# EasyEDA schematic SCH_ACSI2STM-MINI_2026-07-24.json
TITLE: ACSI2STM MINI - SidecarTridge version; REV: 1.0; Date: 2023-08-24; Sheet: 1/1; Drawn By: Jean-Matthieu Coulon; Company: retro16
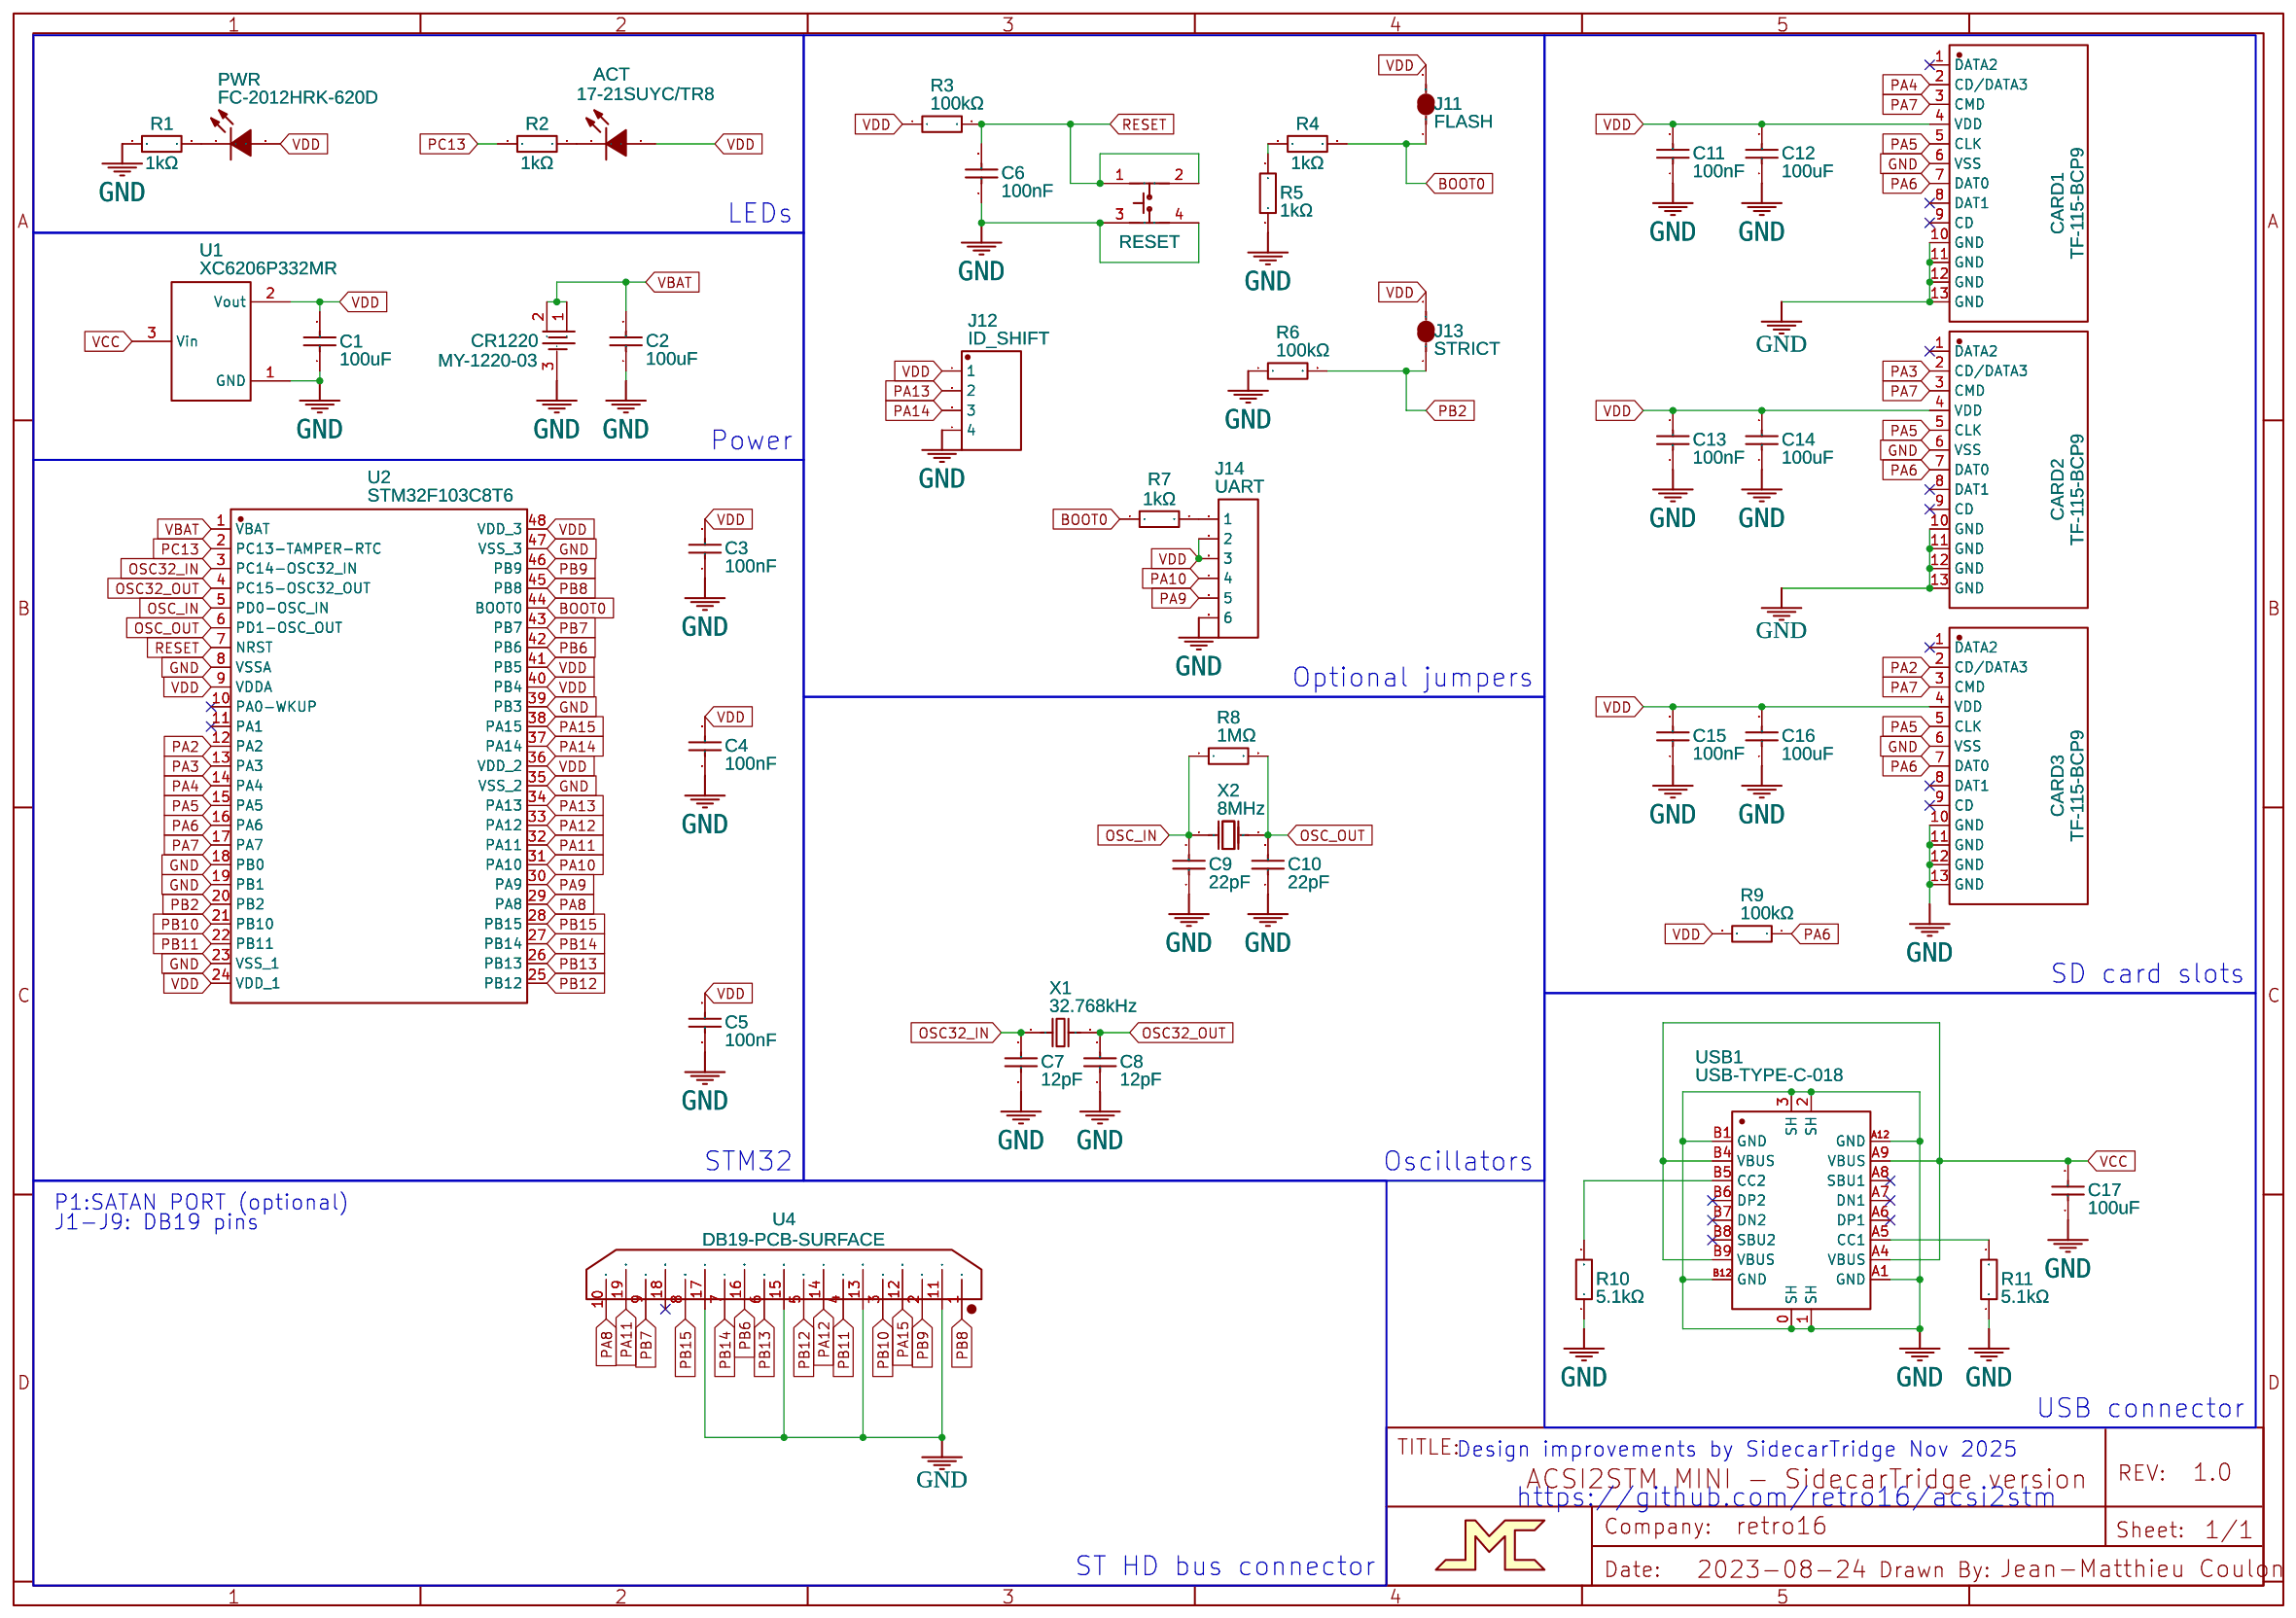
[diagram p0: schematic sheet]

## Parts
ACT  17-21SUYC/TR8  [LED0805-R-RD]
C1  100uF  [C1206]
C2  100uF  [C1206]
C3  100nF  [C0402]
C4  100nF  [C0402]
C5  100nF  [C0402]
C6  100nF  [C0402]
C7  12pF  [C0402]
C8  12pF  [C0402]
C9  22pF  [C0402]
C10  22pF  [C0402]
C11  100nF  [C0402]
C12  100uF  [C1206]
C13  100nF  [C0402]
C14  100uF  [C1206]
C15  100nF  [C1206]
C16  100uF  [C1206]
C17  100uF  [C1206]
CARD1  TF-115-BCP9  [TF-SMD_TF-115-BCP9]
CARD2  TF-115-BCP9  [TF-SMD_TF-115-BCP9]
CARD3  TF-115-BCP9  [TF-SMD_TF-115-BCP9]
CR1220  MY-1220-03  [BAT-SMD_MY-1220-03]
J11  FLASH  [SJ_2S-NO]
J12  ID_SHIFT  [SJ_4]
J13  STRICT  [SJ_2S-NO]
J14  UART  [HDR-F-2.54_1X6]
PWR  FC-2012HRK-620D  [LED0805-RD_RED]
R1  1kΩ  [R0402]
R2  1kΩ  [R0402]
R3  100kΩ  [R0402]
R4  1kΩ  [R0402]
R5  1kΩ  [R0402]
R6  100kΩ  [R0402]
R7  1kΩ  [R0402]
R8  1MΩ  [R0402]
R9  100kΩ  [R0402]
R10  5.1kΩ  [R0402]
R11  5.1kΩ  [R0402]
RESET  SKRPABE010  [KEY-SMD_4P-L4.2-W3.2-P2.20-LS4.6]
U1  XC6206P332MR  [SOT-23-3_L2.9-W1.6-P1.90-LS2.8-BR]
U2  STM32F103C8T6  [LQFP-48_L7.0-W7.0-P0.50-LS9.0-BL]
U3  JMC_LOGO  [JMC_LOGO]
U4  DB19-PCB-SURFACE  [DB19-PCB-SURFACE]
USB1  USB-TYPE-C-018  [USB-C_SMD-TYPE-C-31-M-12]
X1  32.768kHz  [FC-135R_L3.2-W1.5]
X2  8MHz  [CRYSTAL-SMD_L5.0-W3.2]

## Library data of the parts
ACT = 17-21SUYC/TR8: Supplier: LCSC; Manufacturer: KENTO; Manufacturer Part: KT-0805黄灯; Supplier Part: C2296; JLCPCB Part Class: Basic Part
C1 C2 C12 C14 C16 C17 = CL31A107MQHNNNE: Supplier: LCSC; Manufacturer: SAMSUNG(三星); Supplier Part: C15008; JLCPCB Part Class: Basic Part
C3-C6 C11 C13 = CL05B104KO5NNNC: Supplier: LCSC; Manufacturer: SAMSUNG(三星); Supplier Part: C1525; JLCPCB Part Class: Basic Part
C7 C8 = 0402CG120J500NT: Supplier: LCSC; Manufacturer: FH(风华); Supplier Part: C1547; JLCPCB Part Class: Basic Part
C9 C10 = 0402CG220J500NT: Supplier: LCSC; Manufacturer: FH(风华); Supplier Part: C1555; JLCPCB Part Class: Basic Part
C15 = CL31B104KBCNNNC: Supplier: LCSC; Manufacturer: SAMSUNG(三星); Supplier Part: C24497; JLCPCB Part Class: Basic Part
CARD1-CARD3 = TF-115-BCP9: Contributor: LCSC; Supplier: LCSC; Supplier Part: C720505; Manufacturer: XUNPU(讯普); JLCPCB Part Class: Extended Part
CR1220 = MY-1220-03: Supplier: LCSC; Supplier Part: C964818; Manufacturer: MYOUNG(美阳); Contributor: lcsc; JLCPCB Part Class: Extended Part
J11 J13 = SOLDERJUMPERNO: Solder Jumper; Contributor: SparkFun
J12 = SJ-4PAD: Contributor: LCSC; Package Display: No
J14 = HDR-F-2.54_1x6: Supplier Part: C40877; Supplier: LCSC; Contributor: LCEDA_Lib
PWR = FC-2012HRK-620D: Supplier: LCSC; Manufacturer: 国星光电; Manufacturer Part: NCD0805R1; Supplier Part: C84256; JLCPCB Part Class: Basic Part
R1 R2 R4 R5 R7 = 0402WGF1001TCE: Supplier: LCSC; Manufacturer: UNI-ROYAL(厚声); Supplier Part: C11702; Resistance (Ohms): 1K; JLCPCB Part Class: Basic Part
R3 R6 R9 = 0402WGF1003TCE: Supplier: LCSC; Manufacturer: UNI-ROYAL(厚声); Supplier Part: C25741; Resistance (Ohms): 100K; JLCPCB Part Class: Basic Part
R8 = 0402WGF1004TCE: Supplier: LCSC; Manufacturer: UNI-ROYAL(厚声); Supplier Part: C26083; Resistance (Ohms): 1M; JLCPCB Part Class: Basic Part
R10 R11 = 0402WGF5101TCE: Supplier: LCSC; Manufacturer: UNI-ROYAL(厚声); Supplier Part: C25905; Resistance (Ohms): 5.1K; JLCPCB Part Class: Basic Part
RESET = SKRPABE010: Supplier: LCSC; Manufacturer: ALPSALPINE(阿尔卑斯阿尔派); Supplier Part: C115360; JLCPCB Part Class: Extended Part
U1 = XC6206P332MR: Supplier: LCSC; Manufacturer: TOREX(特瑞仕); Supplier Part: C5446; JLCPCB Part Class: Basic Part
U2 = STM32F103C8T6: Supplier: LCSC; Manufacturer: ST(意法半导体); Supplier Part: C8734; JLCPCB Part Class: Basic Part
U3 = JMC_LOGO: Contributor: jmclabexperience
U4 = DB19-PCB-SURFACE: Contributor: crossignol
USB1 = USB-TYPE-C-018: Supplier: LCSC; Supplier Part: C2927038; Manufacturer: DEALON(德艺隆); Contributor: LCSC; JLCPCB Part Class: Extended Part
X1 = Q13FC1350000400: Supplier: LCSC; Manufacturer: EPSON(爱普生); Supplier Part: C32346; JLCPCB Part Class: Basic Part; link: https://lcsc.com/eda_search?q=C32346&%26type=1&ref=editor
X2 = X50328MSB2GI: Supplier: LCSC; Manufacturer: YXC(扬兴晶振); Supplier Part: C115962; JLCPCB Part Class: Basic Part; link: https://lcsc.com/eda_search?q=C115962&%26type=1&ref=editor

## Nets
GND: C1.1 C2.1 C3.1 C4.1 C5.1 C6.1 C7.2 C8.2 C9.1 C10.1 C11.1 C12.1 C13.1 C14.1 C15.1 C16.1 C17.1 CARD1.6(VSS) CARD1.10(GND) CARD1.11(GND) CARD1.12(GND) CARD1.13(GND) CARD2.6(VSS) CARD2.10(GND) CARD2.11(GND) CARD2.12(GND) CARD2.13(GND) CARD3.6(VSS) CARD3.10(GND) CARD3.11(GND) CARD3.12(GND) CARD3.13(GND) CR1220.3(-) J12.4 J14.6 R1.1 R5.1 R6.1 R10.1 R11.1 RESET.3 RESET.4 U1.1(GND) U2.8(VSSA) U2.18(PB0) U2.19(PB1) U2.23(VSS_1) U2.35(VSS_2) U2.39(PB3) U2.47(VSS_3) U4.11 U4.13 U4.15 U4.17 USB1.0(SH) USB1.1(SH) USB1.2(SH) USB1.3(SH) USB1.A1(GND) USB1.A12(GND) USB1.B1(GND) USB1.B12(GND)
VBAT: C2.2 CR1220.1(+) CR1220.2(+) U2.1(VBAT)
VCC: C17.2 U1.3(Vin) USB1.A4(VBUS) USB1.A9(VBUS) USB1.B4(VBUS) USB1.B9(VBUS)
VDD: ACT.1(+) C1.2 C3.2 C4.2 C5.2 C11.2 C12.2 C13.2 C14.2 C15.2 C16.2 CARD1.4(VDD) CARD2.4(VDD) CARD3.4(VDD) J11.2 J12.1 J13.2 J14.2 J14.3 PWR.2(+) R3.1 R9.2 U1.2(Vout) U2.9(VDDA) U2.24(VDD_1) U2.36(VDD_2) U2.40(PB4) U2.41(PB5) U2.48(VDD_3)
BOOT0: J11.1 R4.2 R7.1 U2.44(BOOT0)
OSC32_IN: C7.1 U2.3(PC14-OSC32_IN) X1.1
OSC32_OUT: C8.1 U2.4(PC15-OSC32_OUT) X1.2
OSC_IN: C9.2 R8.1 U2.5(PD0-OSC_IN) X2.1(OSC1)
OSC_OUT: C10.2 R8.2 U2.6(PD1-OSC_OUT) X2.2(OSC2)
PA2: CARD3.2(CD/DATA3) U2.12(PA2)
PA3: CARD2.2(CD/DATA3) U2.13(PA3)
PA4: CARD1.2(CD/DATA3) U2.14(PA4)
PA5: CARD1.5(CLK) CARD2.5(CLK) CARD3.5(CLK) U2.15(PA5)
PA6: CARD1.7(DAT0) CARD2.7(DAT0) CARD3.7(DAT0) R9.1 U2.16(PA6)
PA7: CARD1.3(CMD) CARD2.3(CMD) CARD3.3(CMD) U2.17(PA7)
PA8: U2.29(PA8) U4.10
PA9: J14.5 U2.30(PA9)
PA10: J14.4 U2.31(PA10)
PA11: U2.32(PA11) U4.19
PA12: U2.33(PA12) U4.14
PA13: J12.2 U2.34(PA13)
PA14: J12.3 U2.37(PA14)
PA15: U2.38(PA15) U4.12
PB2: J13.1 R6.2 U2.20(PB2)
PB6: U2.42(PB6) U4.16
PB7: U2.43(PB7) U4.9
PB8: U2.45(PB8) U4.1
PB9: U2.46(PB9) U4.2
PB10: U2.21(PB10) U4.3
PB11: U2.22(PB11) U4.4
PB12: U2.25(PB12) U4.5
PB13: U2.26(PB13) U4.6
PB14: U2.27(PB14) U4.7
PB15: U2.28(PB15) U4.8
PC13: R2.1 U2.2(PC13-TAMPER-RTC)
RESET: C6.2 R3.2 RESET.1 RESET.2 U2.7(NRST)
Net-(ACT-2): ACT.2(-) R2.2
Net-(J14-1): J14.1 R7.2
Net-(PWR-1): PWR.1(-) R1.2
Net-(R4-1): R4.1 R5.2
Net-(R10-2): R10.2 USB1.B5(CC2)
Net-(R11-2): R11.2 USB1.A5(CC1)

Not connected (* = marked no-connect by the designer): CARD1 1(DATA2)* 8(DAT1)* 9(CD)*; CARD2 1(DATA2)* 8(DAT1)* 9(CD)*; CARD3 1(DATA2)* 8(DAT1)* 9(CD)*; U2 10(PA0-WKUP)* 11(PA1)*; U4 18*; USB1 A6(DP1)* A7(DN1)* A8(SBU1)* B6(DP2)* B7(DN2)* B8(SBU2)*

## Notes on the sheet
- LEDs
- Power
- Optional jumpers
- SD card slots
- STM32
- Oscillators
- J1-J9: DB19 pins
- P1:SATAN PORT (optional)
- USB connector
- Design improvements by SidecarTridge Nov 2025
- https://github.com/retro16/acsi2stm
- ST HD bus connector
